# Altium schematic sheet USB-Socket.SchDoc
size A; SheetNumber: 10; SheetTotal: 17
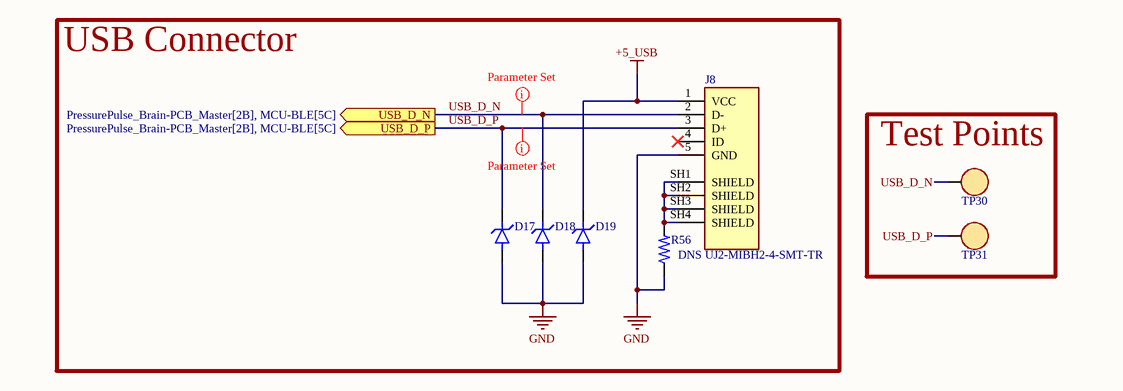
[diagram p0: USB-Socket.SchDoc]

## Parts
D17  RCLAMP0521P.TCT  [BDFN2C051V40]  (value not drawn)
D18  RCLAMP0521P.TCT  [BDFN2C051V40]  (value not drawn)
D19  RCLAMP0521P.TCT  [BDFN2C051V40]  (value not drawn)
J8  UJ2-MIBH2-4-SMT-TR  [USB MICRO JLC]
R56  value DNS  [0402R]  (hidden comment: RES)
TP30  RH-5019  [TP - RH-5019]  (value not drawn)
TP31  RH-5019  [TP - RH-5019]  (value not drawn)

## Blocks framed on the sheet
USB Connector: D17-D19 J8 R56
Test Points: TP30 TP31

## Ports
USB_D_N (out, see PressurePulse_Brain-PCB_Master[2B], MCU-BLE[5C]), USB_D_P (out, see PressurePulse_Brain-PCB_Master[2B], MCU-BLE[5C])

## Nets
+5_USB: D19.K J8.1(VCC)
GND: D17.A D18.A D19.A J8.5(GND) R56.1
USB_D_N: D18.K J8.2(D-) TP30.1 ; port USB_D_N
USB_D_P: D17.K J8.3(D+) TP31.1 ; port USB_D_P
NetJ8_SH1: J8.SH1(SHIELD) J8.SH2(SHIELD) J8.SH3(SHIELD) J8.SH4(SHIELD) R56.2

Not connected (* = marked no-connect by the designer): J8 4(ID)*

## Layout directives
net class USB: USB_D_N, USB_D_P

## Library data of the parts
D17-D19 = TVS DIODE: 25V Clamp 4A (8/20µs) Ipp Tvs Diode Surface Mount SLP1006P2; MFR: BORN; Type: SMD; Value: BDFN2C051V40; MFR PN: BDFN2C051V40; JLCPCB PN: C152023
J8 = Micro USB Port: Micro B, USB 2.0, 1.8 A, Right Angle, Surface Mount (SMT), USB Receptacle; MFR: CUI Devices; Value: UA0507065250-037-06; JLCPCB PN: C5249562
R56 = RES: Resistor; MFR PN: *; MFR: *; JLCPCB PN: *
TP30 TP31 = TEST POINT: MFR: ronghe; MFR PN: RH-5019; Value: RH-5019; JLCPCB PN: C5199800